# Altium schematic sheet TP_IHM_POWER.SchDoc
size A4
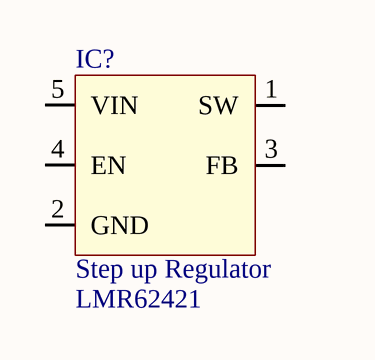
[diagram p0: TP_IHM_POWER.SchDoc]

## Parts
IC?  Step up Regulator  [LMR62421]

## Nets

Not connected (* = marked no-connect by the designer): IC? 1(SW) 2(GND) 3(FB) 4(EN) 5(VIN)

## Library data of the parts
IC? = LMR62421XMF: LMR62421 simple switcher 24 Vout stepup voltage SOT-23; Reference: LMR62421